# Altium schematic sheet 4-Connector.SchDoc
size A4
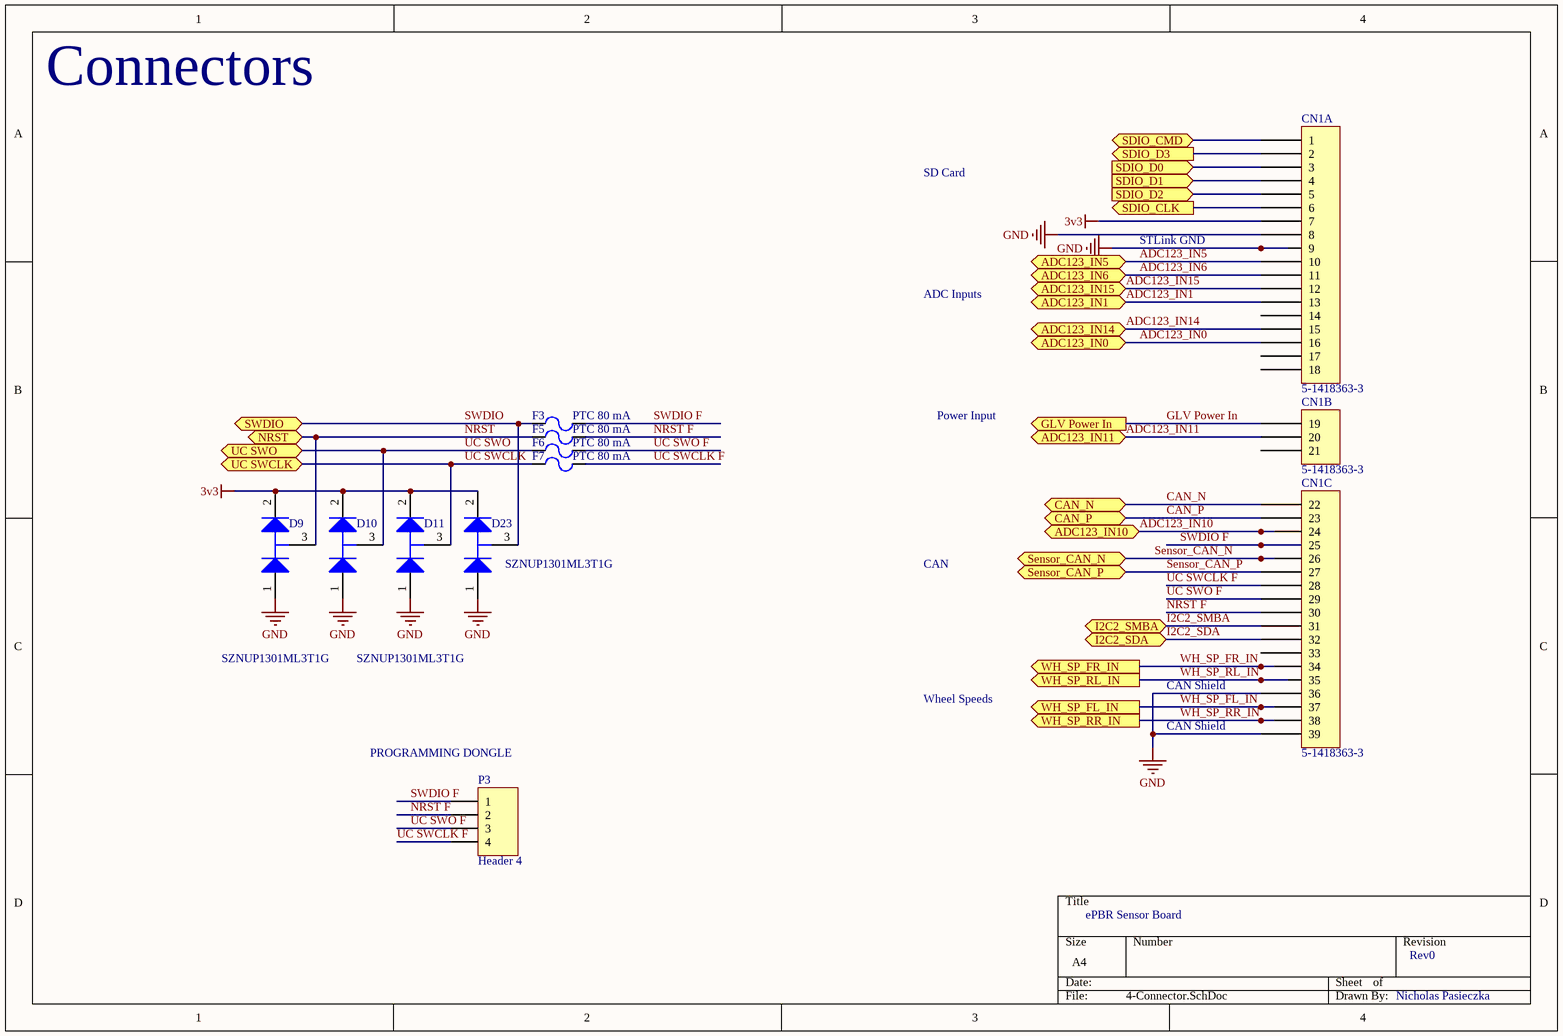
[diagram p0: 4-Connector.SchDoc]

## Parts
CN1  5-1418363-3  [5-1418363-3]  (parts A,B,C of 3)
D9  SZNUP1301ML3T1G  [ONSC-SOT-23-3-318-08_V]
D10  SZNUP1301ML3T1G  [ONSC-SOT-23-3-318-08_V]  (value not drawn)
D11  SZNUP1301ML3T1G  [ONSC-SOT-23-3-318-08_V]
D23  SZNUP1301ML3T1G  [ONSC-SOT-23-3-318-08_V]
F3  PTC 80 mA  [0603 fuse]
F5  PTC 80 mA  [0603 fuse]
F6  PTC 80 mA  [0603 fuse]
F7  PTC 80 mA  [0603 fuse]
P3  Header 4  [HDR1X4]

## Ports
ADC123_IN0 (bidir), ADC123_IN1 (bidir), ADC123_IN5 (bidir), ADC123_IN6 (bidir), ADC123_IN10 (bidir), ADC123_IN11 (bidir), ADC123_IN14 (bidir), ADC123_IN15 (bidir), CAN_N (bidir), CAN_P (bidir), GLV Power In (out), I2C2_SDA (bidir), I2C2_SMBA (bidir), NRST (bidir), SDIO_CLK (out), SDIO_CMD (bidir), SDIO_D0 (in), SDIO_D1 (in), SDIO_D2 (in), SDIO_D3 (out), Sensor_CAN_N (bidir), Sensor_CAN_P (bidir), SWDIO (bidir), UC SWCLK (bidir), UC SWO (bidir), WH_SP_FL_IN (out), WH_SP_FR_IN (out), WH_SP_RL_IN (out), WH_SP_RR_IN (out)

## Nets
3v3: CN1.7 D9.2(K) D10.2(K) D11.2(K) D23.2(K)
GND: CN1.8 CN1.9 CN1.36 CN1.39 D9.1(A) D10.1(A) D11.1(A) D23.1(A)
ADC123_IN0: CN1.16 ; port ADC123_IN0
ADC123_IN1: CN1.13 ; port ADC123_IN1
ADC123_IN5: CN1.10 ; port ADC123_IN5
ADC123_IN6: CN1.11 ; port ADC123_IN6
ADC123_IN10: CN1.24 ; port ADC123_IN10
ADC123_IN11: CN1.20 ; port ADC123_IN11
ADC123_IN14: CN1.15 ; port ADC123_IN14
ADC123_IN15: CN1.12 ; port ADC123_IN15
CAN_N: CN1.22 ; port CAN_N
CAN_P: CN1.23 ; port CAN_P
GLV Power In: CN1.19 ; port GLV Power In
I2C2_SDA: CN1.32 ; port I2C2_SDA
I2C2_SMBA: CN1.31 ; port I2C2_SMBA
NRST: D9.3(K/A) F5.1 ; port NRST
NRST F: CN1.30 F5.2 P3.2
SDIO_CLK: CN1.6 ; port SDIO_CLK
SDIO_CMD: CN1.1 ; port SDIO_CMD
SDIO_D0: CN1.3 ; port SDIO_D0
SDIO_D1: CN1.4 ; port SDIO_D1
SDIO_D2: CN1.5 ; port SDIO_D2
SDIO_D3: CN1.2 ; port SDIO_D3
Sensor_CAN_N: CN1.26 ; port Sensor_CAN_N
Sensor_CAN_P: CN1.27 ; port Sensor_CAN_P
SWDIO: D23.3(K/A) F3.1 ; port SWDIO
SWDIO F: CN1.25 F3.2 P3.1
UC SWCLK: D11.3(K/A) F7.1 ; port UC SWCLK
UC SWCLK F: CN1.28 F7.2 P3.4
UC SWO: D10.3(K/A) F6.1 ; port UC SWO
UC SWO F: CN1.29 F6.2 P3.3
WH_SP_FL_IN: CN1.37 ; port WH_SP_FL_IN
WH_SP_FR_IN: CN1.34 ; port WH_SP_FR_IN
WH_SP_RL_IN: CN1.35 ; port WH_SP_RL_IN
WH_SP_RR_IN: CN1.38 ; port WH_SP_RR_IN

Not connected (* = marked no-connect by the designer): CN1 14 17 18 21 33

## Notes on the sheet
- Connectors
- SD Card
- STLink GND
- ADC Inputs
- Power Input
- CAN
- Wheel Speeds
- CAN Shield
- (near P3) PROGRAMMING DONGLE
- ePBR Sensor Board
- Rev0
- Nicholas Pasieczka

## Library data of the parts
CN1 = 5-1418363-3: Levyseal 90 degree 39 pin header
D9-D11 D23 = CMP-1063-00171-1: Low Capacitance Diode Array for ESD Protection in a Single Data Line, 3-Pin SOT-23, Pb-Free, Tape and Reel; Manufacturer: On Semiconductor; C Max (pF): 0.9; Direction: Bidirectional; V(BR) Min (V): 70; Number of Lines: 1; Mounting Technology: Surface Mount; PackageReference: SOT-23-3-318-08; DatasheetVersion: Rev. 6; PackageVersion: Rev. AP, 11/2009; RoHS: Pb-Free; ComponentLink1Description: Manufacturer URL; ComponentLink1URL: http://www.onsemi.com/; PackageDescription: 3-Pin Small Outline Transistor, Body 2.92 x 1.3 mm, Pitch 0.95 mm; PartNumber: SZNUP1301ML3T1G; Packing: Tape and Reel; ComponentLink3URL: http://www.onsemi.cn/pub_link/Collateral/318-08.PDF; ComponentLink3Description: Package Specification; VRWM Max (V): 70; ComponentLink2Description: Datasheet; ComponentLink2URL: http://www.onsemi.cn/pub_link/Collateral/NUP1301ML3T1-D.PDF; Supplier 1: Mouser; Supplier Part Number 1: 863-SZNUP1301ML3T1G
F3 F5-F7 = PTC fuse 80mA 0ZCM0008FF2G: 0ZCM0008FF2G; Supplier 1: Digi-Key; Supplier Part Number 1: 507-1817-1-ND
P3 = Header 4: Header, 4-Pin; LatestRevisionDate: 17-Jul-2002; LatestRevisionNote: Re-released for DXP Platform.; Publisher: Altium Limited